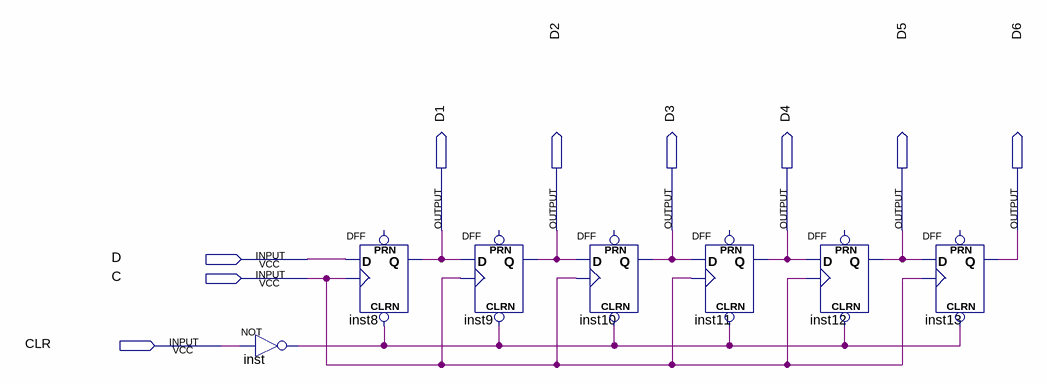
[diagram p0: schematic sheet]
// Quartus schematic lab1.bdf as structural Verilog: 7 symbols, 9 pins
module lab1 (
  input  D,
  input  C,
  input  CLR,
  output D1,
  output D2,
  output D3,
  output D4,
  output D5,
  output D6
);

  wire inst_out;

  not inst (inst_out, CLR);
  DFF inst8 (.CLRN(inst_out), .CLK(C), .D(D), .Q(D1));  // open: PRN
  DFF inst9 (.CLRN(inst_out), .CLK(C), .D(D1), .Q(D2));  // open: PRN
  DFF inst10 (.CLRN(inst_out), .CLK(C), .D(D2), .Q(D3));  // open: PRN
  DFF inst11 (.CLRN(inst_out), .CLK(C), .D(D3), .Q(D4));  // open: PRN
  DFF inst12 (.CLRN(inst_out), .CLK(C), .D(D4), .Q(D5));  // open: PRN
  DFF inst13 (.CLRN(inst_out), .CLK(C), .D(D5), .Q(D6));  // open: PRN
endmodule
